# EAGLE design eigenes_OVMS (EAGLE 6.3)

## Sheet 1 of 3: Power Supply
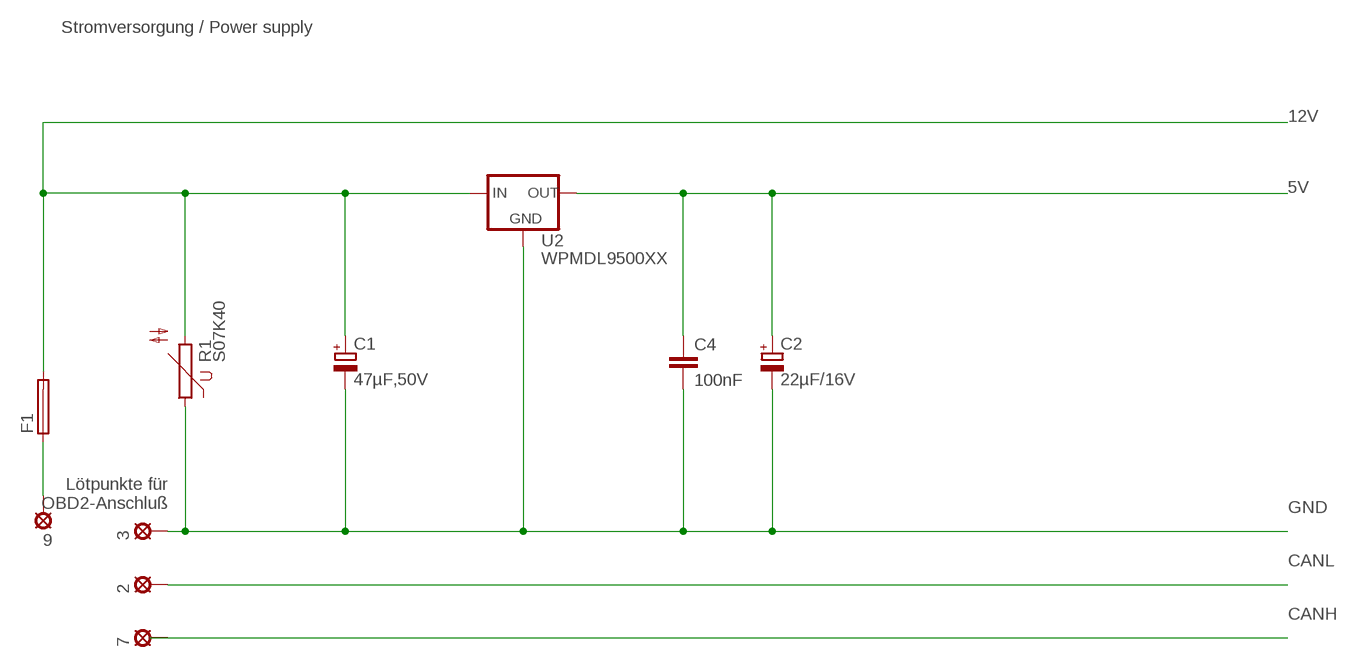
[diagram p0: schematic, sheet 1]

### Parts
2  LSP10  [LSP10]
3  LSP10  [LSP10]
7  LSP10  [LSP10]
9  LSP10  [LSP10]
C1  47µF,50V  CPOL-EUE2.5-7  [E2,5-7]
C2  22µF/16V  CPOL-EUE2.5-5  [E2,5-5]
C4  100nF  C-EU025-025X050  [C025-025X050]
F1  19559  [19559]
R1  S07K40  [S07K40]
U2  WPMDL9500XX  [WPMDL9500]

### Nets
5V: C2.+ C4.1 U2.OUT ; also sheet 2
12V: C1.+ F1.2 R1.2 U2.IN ; also sheet 2,3
CANH: 7.MP ; also sheet 2
CANL: 2.MP ; also sheet 2
GND: 3.MP C1.- C2.- C4.2 R1.1 U2.GND ; also sheet 2,3
N$2: 9.MP F1.1

### Notes on the sheet
- Stromversorgung / Power supply
- Lötpunkte für
  OBD2-Anschluß

## Sheet 2 of 3: PIC, CAN-Bus
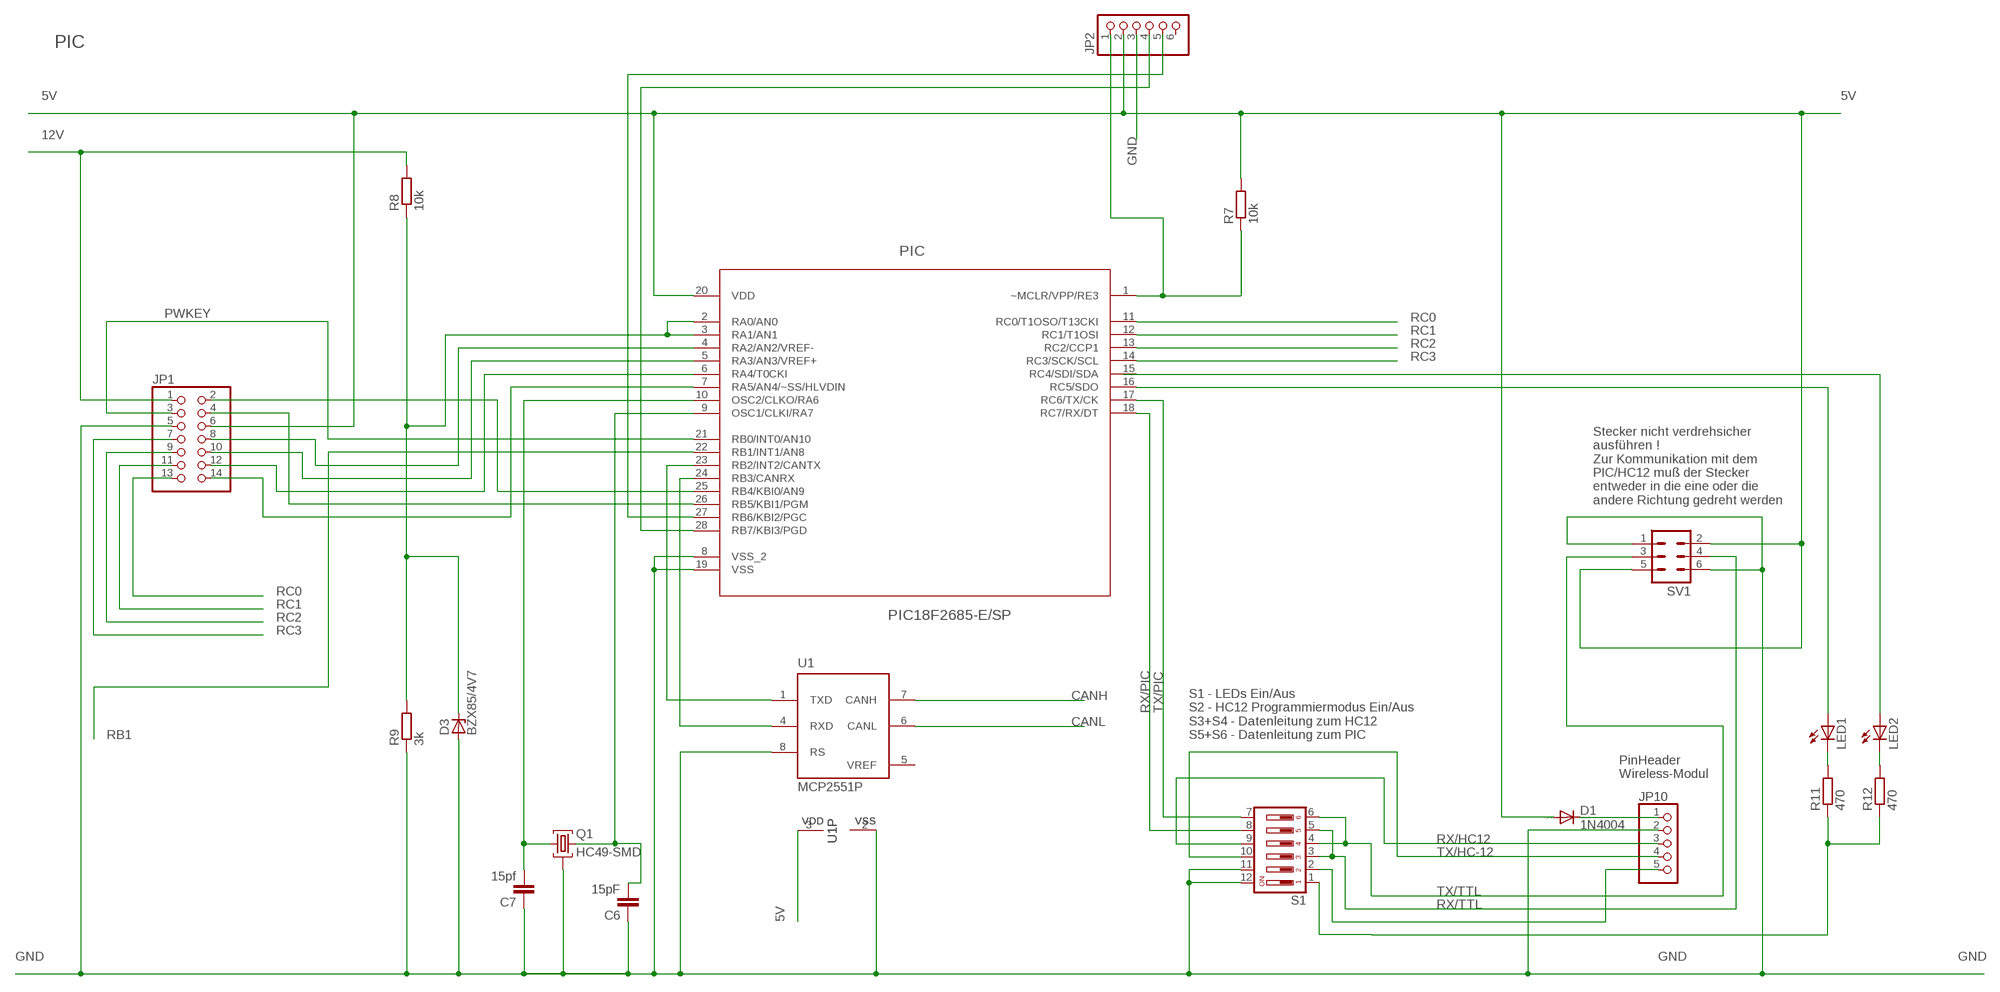
[diagram p1: schematic, sheet 2]

### Parts
C6  15pF  C-EU025-025X050  [C025-025X050]
C7  15pf  C-EU025-025X050  [C025-025X050]
D1  1N4004  [DO41-10]
D3  BZX85/4V7  BZX85  [DO41Z10]
JP1  PINHD-2X7  [2X07]
JP2  PINHD-1X6  [1X06]
JP10  PINHD-1X5  [1X05]
LED1  LED3MM  [LED3MM]
LED2  LED3MM  [LED3MM]
PIC  PIC18F2685-E/SP  [DIP254P762X508-28]
Q1  HC49-SMD  12M10BHC49T  [HC49U]
R7  10k  R-EU_0207/7  [0207/7]
R8  10k  R-EU_0207/7  [0207/7]
R9  3k  R-EU_0207/7  [0207/7]
R11  470  R-EU_0207/7  [0207/7]
R12  470  R-EU_0207/7  [0207/7]
S1  DIP06YL  [DIP06YL]
SV1  ML6L  [ML6L]
U1  MCP2551P  [DIL8]

### Nets
5V: D1.A JP1.6 JP2.2 PIC.20(VDD) R7.2 SV1.2 SV1.5 U1.3(VDD) ; also sheet 1
12V: JP1.1 R8.2 ; also sheet 1,3
CANH: U1.7(CANH) ; also sheet 1
CANL: U1.6(CANL) ; also sheet 1
GND: C6.1 C7.1 D3.A JP1.5 JP2.3 JP10.2 PIC.8(VSS_2) PIC.19(VSS) Q1.2 R9.1 S1.11 S1.12 SV1.1 SV1.6 U1.2(VSS) U1.8(RS) ; also sheet 1,3
N$1: JP2.1 PIC.1(~MCLR/VPP/RE3) R7.1
N$3: C7.2 PIC.10(OSC2/CLKO/RA6) Q1.1
N$4: C6.2 PIC.9(OSC1/CLKI/RA7) Q1.3
N$5: PIC.23(RB2/INT2/CANTX) U1.1(TXD)
N$6: PIC.24(RB3/CANRX) U1.4(RXD)
N$7: LED2.A PIC.15(RC4/SDI/SDA)
N$8: LED1.A PIC.16(RC5/SDO)
N$12: JP2.4 PIC.28(RB7/KBI3/PGD)
N$13: JP2.5 PIC.27(RB6/KBI2/PGC)
N$15: JP1.8 PIC.4(RA2/AN2/VREF-)
N$16: JP1.10 PIC.5(RA3/AN3/VREF+)
N$17: JP1.12 PIC.6(RA4/T0CKI)
N$19: D1.C JP10.1
N$20: LED1.K(C) R11.2
N$21: LED2.K(C) R12.2
N$22: R11.1 R12.1 S1.1
N$23: JP1.14 PIC.7(RA5/AN4/~SS/HLVDIN)
N$45: JP10.5 S1.2
PWKEY: JP1.3 PIC.21(RB0/INT0/AN10)
RA1: D3.C PIC.2(RA0/AN0) PIC.3(RA1/AN1) R8.1 R9.2
RB1: PIC.22(RB1/INT1/AN8) ; also sheet 3
RB4: JP1.2 PIC.25(RB4/KBI0/AN9)
RB5: JP1.4 PIC.26(RB5/KBI1/PGM)
RC0: JP1.13 PIC.11(RC0/T1OSO/T13CKI)
RC1: JP1.11 PIC.12(RC1/T1OSI)
RC2: JP1.9 PIC.13(RC2/CCP1)
RC3: JP1.7 PIC.14(RC3/SCK/SCL)
RX/HC12: JP10.3 S1.9
RX/PIC: PIC.18(RC7/RX/DT) S1.8
RX/TTL: S1.3 S1.5 SV1.4
TX/HC-12: JP10.4 S1.10
TX/PIC: PIC.17(RC6/TX/CK) S1.7
TX/TTL: S1.4 S1.6 SV1.3
Unconnected: JP2.6

### Notes on the sheet
- PIC
- Stecker nicht verdrehsicher
  ausführen !
  Zur Kommunikation mit dem
  PIC/HC12 muß der Stecker
  entweder in die eine oder die
  andere Richtung gedreht werden
- S1 - LEDs Ein/Aus
  S2 - HC12 Programmiermodus Ein/Aus
  S3+S4 - Datenleitung zum HC12
  S5+S6 - Datenleitung zum PIC
- PinHeader
  Wireless-Modul

## Sheet 3 of 3: Fan Control
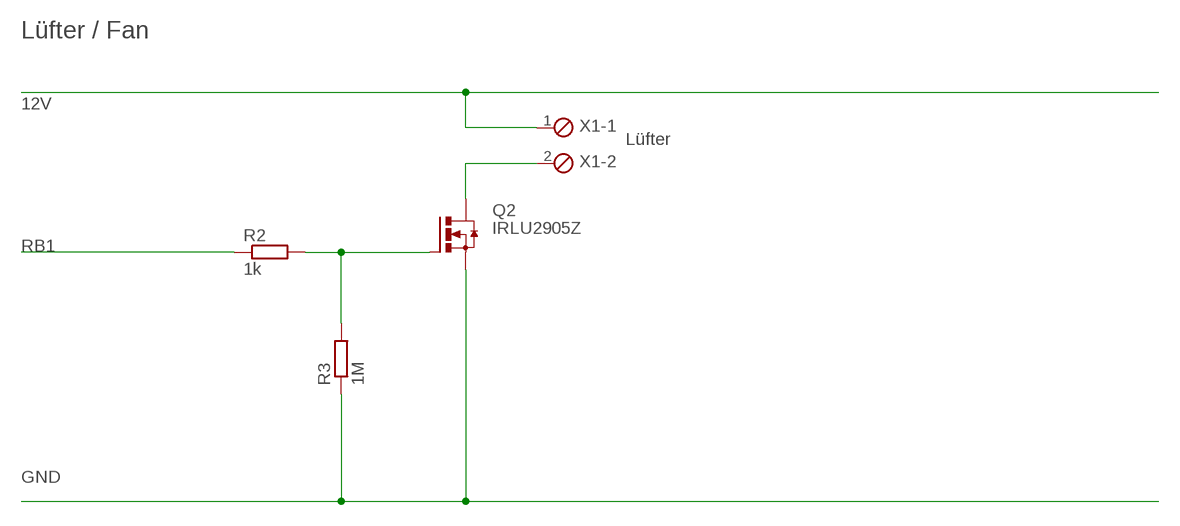
[diagram p2: schematic, sheet 3]

### Parts
Q2  IRLU2905Z  [TO251AA-V]
R2  1k  R-EU_0207/7  [0207/7]
R3  1M  R-EU_0207/7  [0207/7]
X1  MPT2  [2POL254]

### Nets
12V: X1.1 ; also sheet 1,2
GND: Q2.3(S) R3.1 ; also sheet 1,2
N$9: Q2.1(G) R2.2 R3.2
N$11: Q2.2(D) X1.2
RB1: R2.1 ; also sheet 2

### Notes on the sheet
- Lüfter / Fan
- Lüfter

## Power pins joined to a net without a drawn wire
VREF: U1.5(VREF)

## Library data of the parts
2 3 7 9 = solpad:LSP10: SOLDER PAD drill 1.0 mm, distributor Buerklin, 12H555
C1 C2 = rcl:CPOL-EU: POLARIZED CAPACITOR, European symbol
C4 C6 C7 = rcl:C-EU: CAPACITOR, European symbol
D1 = diode:1N4004: DIODE general purpose rectifier, 1 A
D3 = diode:BZX85: Z DIODE
F1 = fuse:19559: FUSE HOLDER TR5, Wickmann; MPN: 55900000001; OC_FARNELL: 9516360; OC_NEWARK: 02P0286
JP1 = pinhead:PINHD-2X7: PIN HEADER
JP2 = pinhead:PINHD-1X6: PIN HEADER
JP10 = pinhead:PINHD-1X5: PIN HEADER
LED1 LED2 = led:LED: LED OSRAM: - CHIPLED LG R971, LG N971, LY N971, LG Q971, LY Q971, LO R971, LY R971 LH N974, LH R974 LS Q976, LO Q976, LY Q976 LO Q996 - Hyper CHIPLED LW Q18S LB Q993, LB Q99A, LB R99A - SideLED LS A670, LO A670, LY A670, LG A670, LP A670 LB A673, LV A673, LT A673, LW A673 LH A674 LY A675 LS A676, LA A676, LO A676, LY A676, LW A676 LS A679, LY A679, LG A679 - Hyper Micro SIDELED® LS Y876, LA Y876, LO Y876, LY Y876 LT Y87S - SmartLED LW L88C, LW L88S LB L89C, LB L89S, LG L890 LS L89K, LO L89K, LY L89K LS L896, LA L896, LO L896, LY L896 - TOPLED LS T670, LO T670, LY T670, LG T670, LP T670 LSG T670, LSP T670, LSY T670, LOP T670, LYG T670 LG T671, LOG T671, LSG T671 LB T673, LV T673, LT T673, LW T673 LH T674 LS T676, LA T676, LO T676, LY T676, LB T676, LH T676, LSB T676, LW T676 LB T67C, LV T67C, LT T67C, LS T67K, LO T67K, LY T67K, LW E67C LS E67B, LA E67B, LO E67B, LY E67B, LB E67C, LV E67C, LT E67C LW T67C LS T679, LY T679, LG T679 LS T770, LO T770, LY T770, LG T770, LP T770 LB T773, LV T773, LT T773, LW T773 LH T774 LS E675, LA E675, LY E675, LS T675 LS T776, LA T776, LO T776, LY T776, LB T776 LHGB T686 LT T68C, LB T68C - Hyper Mini TOPLED® LB M676 - Mini TOPLED Santana® LG M470 LS M47K, LO M47K, LY M47K Source: http://www.osram.convergy.de LUXEON: - LUMILED® LXK2-PW12-R00, LXK2-PW12-S00, LXK2-PW14-U00, LXK2-PW14-V00 LXK2-PM12-R00, LXK2-PM12-S00, LXK2-PM14-U00 LXK2-PE12-Q00, LXK2-PE12-R00, LXK2-PE12-S00, LXK2-PE14-T00, LXK2-PE14-U00 LXK2-PB12-K00, LXK2-PB12-L00, LXK2-PB12-M00, LXK2-PB14-N00, LXK2-PB14-P00, LXK2-PB14-Q00 LXK2-PR12-L00, LXK2-PR12-M00, LXK2-PR14-Q00, LXK2-PR14-R00 LXK2-PD12-Q00, LXK2-PD12-R00, LXK2-PD12-S00 LXK2-PH12-R00, LXK2-PH12-S00 LXK2-PL12-P00, LXK2-PL12-Q00, LXK2-PL12-R00 Source: www.luxeon.com KINGBRIGHT: KA-3528ASYC Source: www.kingbright.com
PIC = Microchip_By_element14_Batch_1:PIC18F2685-E/SP: Enhanced Flash Microcontrollers; DESCRIPTION: Enhanced Flash Microcontrollers; MPN: PIC18F2685-E/SP; OC_FARNELL: 1579606; OC_NEWARK: 08N6592; PACKAGE: DIP-28; SUPPLIER: Microchip
Q1 = crystal:12M10BHC49T: Monolithic Crystal Filters Source: www.vanlong.com; OC_FARNELL: unknown; OC_NEWARK: unknown
Q2 = transistor-power:IRLU2905Z: HEXFET-Power MOSFET Automotive
R1 = varistor:S07K40: VARISTOR
R2 R3 = resistor:R-EU_: RESISTOR, European symbol
R7-R9 R11 R12 = rcl:R-EU_: RESISTOR, European symbol
S1 = switch-dil:DIP06YL: DIL/CODE SWITCH; OC_FARNELL: unknown; OC_NEWARK: unknown
SV1 = con-harting-ml:ML6: HARTING; OC_FARNELL: unknown; OC_NEWARK: unknown
U1 = microchip_can:MCP2551: High Speed CAN tranceiver
U2 = v-reg:WPMDL9500XX: Voltage Regulator Würth
X1 = con-phoenix-254:MPT2: PHOENIX CONNECTOR; OC_FARNELL: unknown; OC_NEWARK: unknown

## Board
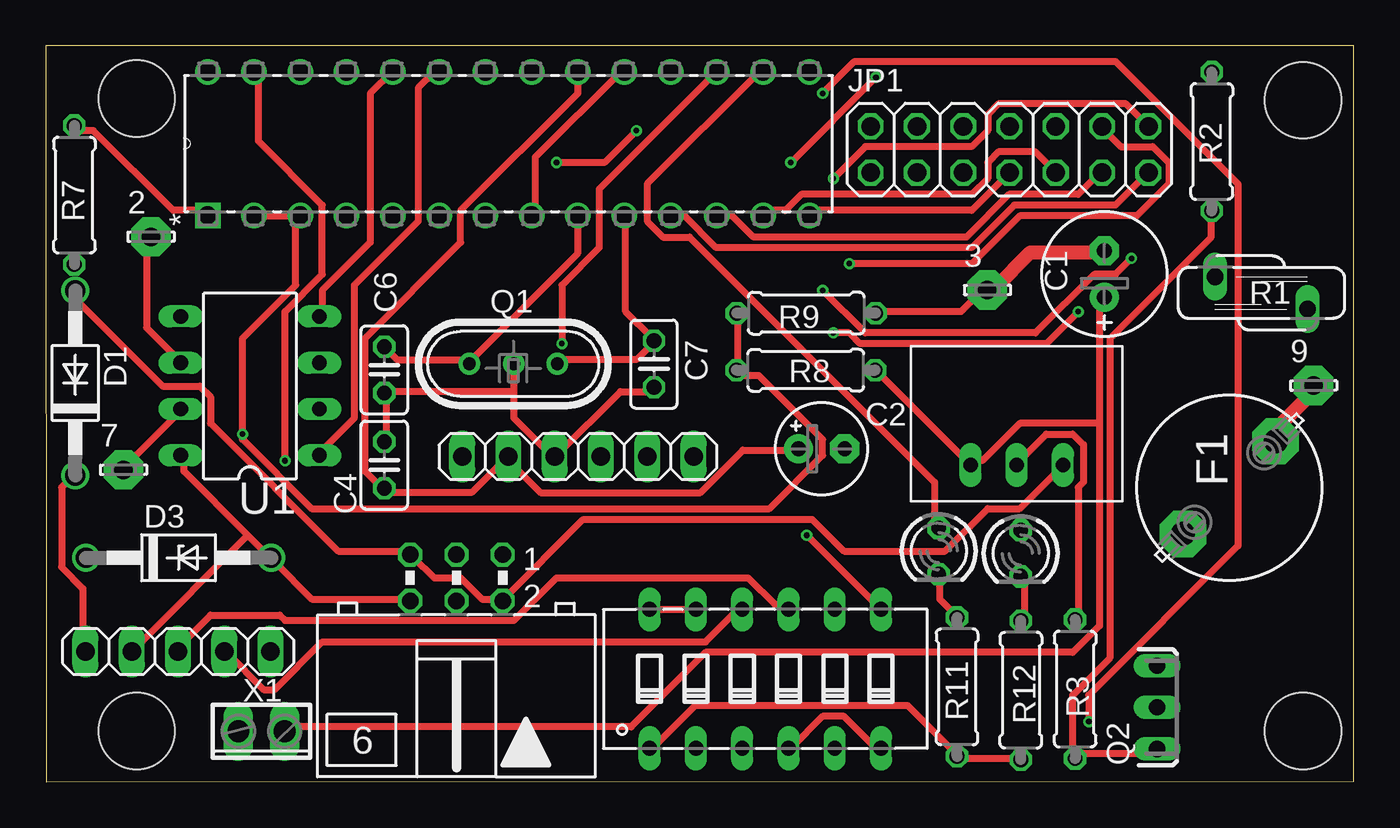
[diagram p3: board, top side]
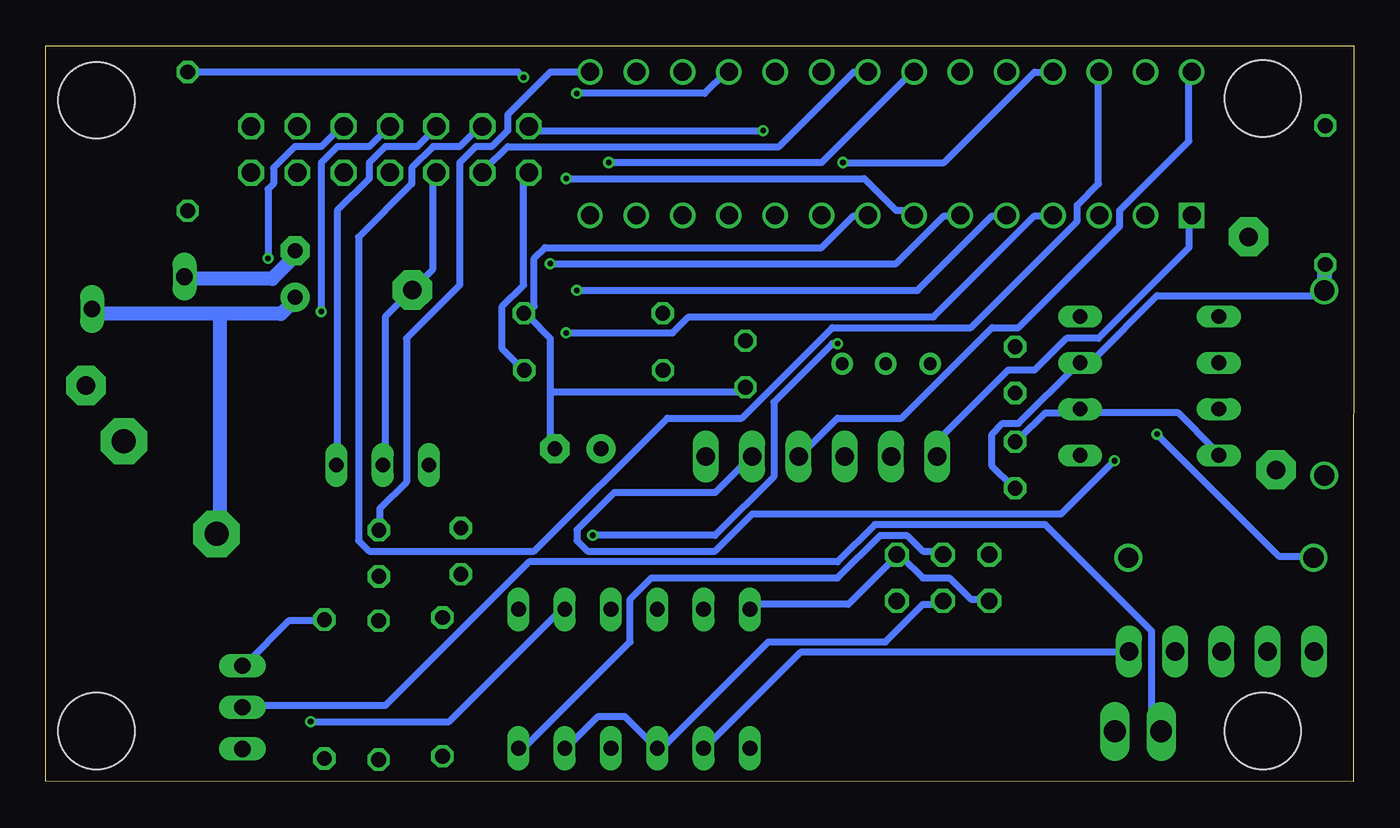
[diagram p4: board, bottom side, seen from below]

Size 71.8 x 40.4 mm. Coordinates in mm from the lower left corner, seen from the top.
Outline: 0.05,0 71.8,0.04 71.8,40.4 0,40.4 0.05,0
Copper layers (1*16): Top 0.035mm / dielectric 1.5mm / Bottom 0.035mm
Design rules "basista_035um-cu_dicke *": minimum track width 15mil, minimum drill 12mil, track to track 8mil, track to pad 8mil, pad to pad 8mil, via to via 8mil, smd to smd 6mil, copper to edge 20mil, drill to drill 8mil, minimum pad ring 8mil, minimum via ring 6mil, stop-mask expansion 3mil, vias tented up to drill 0mil, thermal gap 8mil
Holes 4.2 mm at 5,37.5 5,2.8 69,2.8 69,37.4

### Footprints (pad centres in the part's own frame; a part is rotated, then mirrored left to right if it is on the bottom)
LSP10 = drill 1.016 pad 2.159 octagon: MP 0,0
E2,5-7 = drill 0.813 pad 1.6: + -1.27,0 | drill 0.813 pad 1.6 octagon: - 1.27,0
E2,5-5 = drill 0.813 pad 1.6: + -1.27,0 | drill 0.813 pad 1.6 octagon: - 1.27,0
C025-025X050 = drill 0.813 octagon: 1 -1.27,0; 2 1.27,0
DO41-10 = drill 1.118: A 5.08,0; C -5.08,0
DO41Z10 = drill 1.118: A 5.08,0; C -5.08,0
19559 = drill 1.321 pad 2.54 octagon: 1 -2.54,2.54; 2 2.54,-2.54
2X07 = drill 1.016 octagon: 1 -7.62,-1.27; 2 -7.62,1.27; 3 -5.08,-1.27; 4 -5.08,1.27; 5 -2.54,-1.27; 6 -2.54,1.27; 7 0,-1.27; 8 0,1.27; 9 2.54,-1.27; 10 2.54,1.27; 11 5.08,-1.27; 12 5.08,1.27; 13 7.62,-1.27; 14 7.62,1.27
1X06 = drill 1.016 long: 1 -6.35,0; 2 -3.81,0; 3 -1.27,0; 4 1.27,0; 5 3.81,0; 6 6.35,0
1X05 = drill 1.016 long: 1 -5.08,0; 2 -2.54,0; 3 0,0; 4 2.54,0; 5 5.08,0
LED3MM = drill 0.813 octagon: A -1.27,0; K 1.27,0
DIP254P762X508-28 = drill 0.991 square: 1 -7.874,33.02 | drill 0.991: 2 -7.874,30.48; 3 -7.874,27.94; 4 -7.874,25.4; 5 -7.874,22.86; 6 -7.874,20.32; 7 -7.874,17.78; 8 -7.874,15.24; 9 -7.874,12.7; 10 -7.874,10.16; 11 -7.874,7.62; 12 -7.874,5.08; 13 -7.874,2.54; 14 -7.874,0; 15 0,0; 16 0,2.54; 17 0,5.08; 18 0,7.62; 19 0,10.16; 20 0,12.7; 21 0,15.24; 22 0,17.78; 23 0,20.32; 24 0,22.86; 25 0,25.4; 26 0,27.94; 27 0,30.48; 28 0,33.02
HC49U = drill 0.7 pad 1.2: 1 -2.413,0; 2 -0.027,0; 3 2.413,0
TO251AA-V = drill 0.889 long: 1 -2.286,0; 2 0,0; 3 2.286,0
S07K40 = drill 0.914 long: 1 -0.889,-2.54; 2 0.889,2.54
0207/7 = drill 0.813 octagon: 1 -3.81,0; 2 3.81,0
DIP06YL = drill 0.813 long: 1 -6.35,-3.81; 2 -3.81,-3.81; 3 -1.27,-3.81; 4 1.27,-3.81; 5 3.81,-3.81; 6 6.35,-3.81; 7 6.35,3.81; 8 3.81,3.81; 9 1.27,3.81; 10 -1.27,3.81; 11 -3.81,3.81; 12 -6.35,3.81
ML6L = drill 0.914 octagon: 1 -2.54,-1.27; 2 -2.54,1.27; 3 0,-1.27; 4 0,1.27; 5 2.54,-1.27; 6 2.54,1.27
DIL8 = drill 0.813 long: 1 -3.81,-3.81; 2 -1.27,-3.81; 3 1.27,-3.81; 4 3.81,-3.81; 5 3.81,3.81; 6 1.27,3.81; 7 -1.27,3.81; 8 -3.81,3.81
WPMDL9500 = drill 0.8 long: GND 0,0; IN -2.54,0; OUT 2.54,0
2POL254 = drill 1.2 long: 1 -1.27,0; 2 1.27,0

### Placement (x,y rotation side)
2  5.78,29.91 0 top
3  51.68,26.99 0 top
7  4.28,17.13 0 top
9  69.58,21.75 0 top
C1  58.11,27.87 90 top
C2  42.58,18.28 0 top
C4  18.59,17.39 90 top
C6  18.59,22.61 90 top
C7  33.39,22.93 90 top
D1  1.63,21.89 90 top
D3  7.3,12.3 0 top
F1  64.96,16.15 270 top
JP1  52.9,34.7 0 top
JP2  29.21,17.86 0 top
JP10  7.27,7.16 0 top
LED1  49.01,12.67 270 top
LED2  53.51,12.55 270 top
PIC  41.92,38.96 90 top
Q1  25.67,22.94 180 top
Q2  61,4.1 90 top
R1  66.71,26.83 270 top
R2  64,35.14 270 top
R3  56.5,5.1 270 top
R7  1.58,32.2 270 top
R8  41.72,22.59 0 top
R9  41.74,25.72 180 top
R11  50.02,5.22 90 top
R12  53.52,5.04 90 top
S1  39.5,5.66 0 top
SV1  22.55,11.2 180 top
U1  11.22,21.73 90 top
U2  53.3,17.4 0 top
X1  11.85,2.78 180 top

### Tracks (layer width: path | path; a pad name or v marks a point on that pad's centre or on a via)
5V
  Top 0.381: 1.75,26.97 D1.A 1.46,26.68 6.43,21.71 8.47,21.71 9.05,21.13 9.05,19.67 16.07,12.66 19.86,12.66 SV1.5 20.16,12.36 21.32,11.2 22.78,11.2 23.95,10.03 24.83,10.03 SV1.2 25.12,10.03 29.5,14.41 42.06,14.41 43.81,12.66 49.37,12.66 51.7,14.99 53.45,14.99 55.79,17.33 U2.OUT | PIC.20 29.21,38.95 29.21,37.78 22.78,31.35 22.78,29.6 17.53,24.34 17.53,17.04 18.4,16.16 C4.1 18.69,15.87 23.37,15.87 25.12,17.62 JP2.2 25.41,17.62 27.16,15.87 35.93,15.87 38.27,18.21 41.19,18.21 C2.+
  Bottom 0.381: U2.OUT 55.79,17.62 55.79,31.35 54.04,33.1 54.04,33.98 53.16,34.86 51.41,34.86 50.53,35.73 JP1.6 | C4.1 18.69,16.16 19.86,17.33 19.86,19.08 19.28,19.67 18.4,19.67 15.19,22.88 U1.3 14.9,23.17 14.31,23.17 10.81,26.68 1.75,26.68 D1.A
  Bottom 0.813: R7.2 1.63,28.39 D1.A
12V
  Top 0.381: R8.2 45.57,22.59 50.53,17.62 U2.IN 50.83,17.62 51.41,17.62 53.45,19.67 57.84,19.67 | 57.84,19.67 57.84,26.39 C1.+ | 57.84,19.67 57.84,8.57 56.38,7.11 36.22,7.11 32.13,3.02 13.14,3.02 X1.1
  Bottom 0.381: JP1.1 45.57,33.4 45.57,27.26 46.74,26.09 46.74,23.76 45.57,22.59 R8.2
  Bottom 0.762: 62.26,25.67 58.88,25.67 58.4,26.16 C1.+ | 62.26,25.67 69.01,25.67 R1.2 | 62.26,25.67 62.26,13.61 F1.2
CANH
  Top 0.381: U1.7 7.3,20.25 4.38,17.33 7.MP
CANL
  Top 0.381: U1.6 7.3,23.17 5.55,24.92 5.55,29.89 2.MP
GND
  Top 0.381: C4.2 18.69,18.79 18.69,21.13 C6.1 18.69,21.42 25.7,21.42 | 25.7,21.42 25.7,19.96 27.75,17.91 JP2.3 28.04,17.91 31.55,21.42 33.3,21.42 C7.1 | 25.7,21.42 25.7,22.88 Q1.2 | S1.12 33.3,9.44 35.64,9.44 S1.11 | 11.1,13.53 12.27,12.36 D3.A 12.56,12.07 14.61,10.03 19.86,10.03 SV1.6 | 11.1,13.53 7.59,17.04 7.59,17.91 U1.8 | 11.1,13.53 4.97,7.4 JP10.2 | PIC.8 26.87,31.35 26.87,34.27 31.55,38.95 PIC.19 | R9.1 45.57,25.8 50.24,25.8 51.41,26.97 3.MP | R3.1 56.67,9.15 56.67,16.16 56.96,16.45 56.96,18.5 56.38,19.08 54.91,19.08 53.45,17.62 U2.GND
  Top 0.762: C1.- 57.91,29.05 54.05,29.05 52.12,27.12 3.MP
  Bottom 0.381: C4.2 18.4,18.79 16.94,20.25 15.19,20.25 U1.2 14.9,20.25 9.64,20.25 7.59,18.21 U1.8 | SV1.6 20.16,10.03 21.03,10.03 22.2,11.2 23.66,11.2 24.83,12.36 SV1.1 25.12,12.36 27.75,9.74 33.01,9.74 S1.12 | R3.1 56.67,8.86 58.42,8.86 60.76,6.52 Q2.3 | U2.GND 53.16,17.62 53.16,25.51 51.7,26.97 3.MP 51.41,27.26 50.53,28.14 50.53,33.4 JP1.5 | 44.11,21.42 44.11,24.34 45.28,25.51 R9.1 45.28,25.8 44.98,26.09 44.98,28.72 44.4,29.31 29.21,29.31 27.46,31.06 26.87,31.06 PIC.8 | 44.11,21.42 44.11,18.5 C2.- | 44.11,21.42 33.59,21.42 C7.1
  Bottom 0.762: R1.1 63.7,27.6 59.36,27.6 57.91,29.05 C1.-
N$1
  Top 0.381: R7.1 1.75,35.73 2.63,35.73 7.01,31.35 8.76,31.35 PIC.1
  Bottom 0.381: JP2.1 22.78,17.91 22.78,18.79 18.99,22.59 17.53,22.59 15.77,24.34 14.02,24.34 9.05,29.31 9.05,31.06 PIC.1
N$2
  Top 0.762: 9.MP 69.49,21.33 67.08,18.92 F1.1
N$3
  Top 0.381: Q1.1 28.33,23.17 32.42,23.17 33.3,24.05 C7.2 33.3,24.34 31.84,25.8 31.84,31.06 PIC.10
N$4
  Top 0.381: C6.2 18.69,23.76 19.28,23.17 23.08,23.17 Q1.3 23.37,23.17 29.21,29.01 29.21,31.06 PIC.9
N$5
  Top 0.381: U1.1 15.19,18.21 16.94,19.96 16.94,27.26 20.45,30.77 20.45,38.07 21.32,38.95 PIC.23
N$6
  Top 0.381: U1.4 15.19,25.8 15.19,26.97 17.82,29.6 17.82,37.78 18.99,38.95 PIC.24
N$7
  Bottom 0.381: LED2.A 53.45,13.83 53.45,14.99 51.99,16.45 51.99,24.34 49.07,27.26 49.07,33.98 48.2,34.86 47.32,34.86 46.44,35.73 46.44,36.61 44.11,38.95 42.06,38.95 PIC.15
N$8
  Top 0.381: LED1.A 48.78,14.12 48.78,16.45 35.34,29.89 33.88,29.89 33.01,30.77 33.01,32.81 39.14,38.95 PIC.16
N$9
  Top 0.381: Q2.1 60.76,1.56 56.67,1.56 R3.2 56.38,1.56 56.38,4.77 58.42,6.81 58.42,24.34 63.97,29.89 63.97,31.06 R2.2
N$11
  Bottom 0.381: Q2.2 60.76,4.19 53.16,4.19 45.28,12.07 28.33,12.07 26.29,14.12 16.94,14.12 11.1,8.28 11.1,3.31 10.81,3.02 X1.2
N$12
  Bottom 0.381: PIC.28 9.05,38.95 9.05,35.15 12.85,31.35 12.85,30.47 18.4,24.92 19.86,24.92 24.83,19.96 28.33,19.96 30.38,17.91 JP2.4
N$13  (via drill 0.3)
  Top 0.381: v13.14,17.62 13.14,25.8 15.19,27.85 15.19,31.64 11.68,35.15 11.68,38.95 PIC.27
  Bottom 0.381: v13.14,17.62 16.07,14.7 33.01,14.7 35.05,12.66 42.06,12.66 42.65,13.24 42.65,13.83 40.6,15.87 35.05,15.87 33.3,17.62 JP2.5
N$15  (via drill 0.3)
  Top 0.381: v43.23,24.63 44.11,24.63 44.69,24.05 54.91,24.05 v56.67,25.8
  Bottom 0.381: v43.23,24.63 37.39,24.63 36.51,25.51 23.08,25.51 17.53,31.06 16.65,31.06 PIC.4 | v56.67,25.8 56.67,33.98 55.79,34.86 54.04,34.86 53.16,35.73 JP1.8
N$16  (via drill 0.3)
  Top 0.381: v42.65,26.97 44.98,24.63 54.33,24.63 57.54,27.85 58.71,27.85 v59.59,28.72
  Bottom 0.381: v42.65,26.97 23.95,26.97 19.86,31.06 19.28,31.06 PIC.5 | v59.59,28.72 59.59,32.52 59.3,32.81 59.3,33.69 58.13,34.86 56.67,34.86 55.5,36.02 JP1.10
N$17  (via drill 0.3)
  Top 0.381: v44.11,28.43 50.83,28.43 53.45,31.06 59.88,31.06 61.63,32.81 61.63,33.98 60.76,34.86 59,34.86 58.13,35.73 JP1.12
  Bottom 0.381: v44.11,28.43 25.12,28.43 22.49,31.06 21.61,31.06 PIC.6
N$19
  Top 0.381: JP10.1 2.04,7.4 2.04,10.61 0.88,11.78 0.88,16.16 1.46,16.75 D1.C
N$20
  Top 0.381: LED1.K 49.07,11.2 49.07,10.03 49.95,9.15 R11.2
N$21
  Top 0.381: LED2.K 53.75,11.2 53.75,8.86 R12.2
N$22
  Top 0.381: R12.1 53.45,1.26 50.24,1.26 R11.1 49.95,1.56 47.32,4.19 35.64,4.19 33.3,1.85 S1.1
N$23  (via drill 0.3)
  Top 0.381: v43.23,33.1 44.98,34.86 50.83,34.86 51.7,35.73 51.7,36.61 52.29,37.19 59.3,37.19 60.47,36.02 JP1.14
  Bottom 0.381: v43.23,33.1 26.87,33.1 25.12,31.35 24.24,31.35 PIC.7
N$45
  Bottom 0.381: S1.2 35.64,1.85 30.38,7.11 12.56,7.11 JP10.5
PWKEY
  Bottom 0.381: PIC.21 26.87,38.95 27.46,38.95 31.55,34.86 46.44,34.86 47.61,33.69 JP1.3
RA1  (via drill 0.3)
  Top 0.381: R9.2 37.97,25.51 37.97,22.59 R8.1 37.97,22.3 39.14,22.3 42.65,18.79 42.65,17.91 39.73,14.99 14.61,14.99 10.81,18.79 v10.81,19.08 10.81,24.34 13.73,27.26 13.73,31.06 PIC.3
  Top 0.406: 13.73,31.06 11.44,31.06 PIC.2
  Bottom 0.381: v10.81,19.08 4.09,12.36 2.34,12.36 D3.C
RB1  (via drill 0.3)
  Top 0.381: v40.89,33.98 v45.57,38.65
  Bottom 0.381: v45.57,38.65 45.86,38.95 63.97,38.95 R2.1 | v40.89,33.98 29.21,33.98 24.24,38.95 PIC.22
RB4  (via drill 0.3)
  Top 0.381: v28.04,33.98 30.67,33.98 v32.42,35.73
  Bottom 0.381: v28.04,33.98 22.49,33.98 17.53,38.95 16.65,38.95 PIC.25 | v32.42,35.73 45.28,35.73 JP1.2
RB5
  Bottom 0.381: PIC.26 14.02,38.95 14.02,32.81 15.19,31.64 15.19,30.77 21.03,24.92 28.63,24.92 33.59,19.96 37.68,19.96 44.98,12.66 54.04,12.66 54.62,13.24 54.62,29.89 51.7,32.81 51.7,33.69 50.53,34.86 49.07,34.86 47.9,36.02 JP1.4
RC0
  Top 0.381: PIC.11 34.47,31.06 35.05,31.06 36.8,29.31 50.83,29.31 53.16,31.64 58.71,31.64 60.47,33.4 JP1.13
RC1
  Top 0.381: PIC.12 37.1,31.06 37.68,31.06 38.85,29.89 50.53,29.89 52.87,32.23 56.67,32.23 57.84,33.4 JP1.11
RC2
  Top 0.381: PIC.13 39.43,31.35 40.6,31.35 41.48,32.23 50.83,32.23 51.7,33.1 51.7,33.98 52.29,34.56 54.33,34.56 55.21,33.69 JP1.9
RC3
  Top 0.381: PIC.14 42.06,31.35 50.83,31.35 52.87,33.4 JP1.7
RX/HC12
  Top 0.381: S1.9 40.6,9.74 40.02,9.74 38.56,11.2 28.04,11.2 25.7,8.86 13.14,8.86 12.85,9.15 9.05,9.15 7.3,7.4 JP10.3
RX/PIC  (via drill 0.3)
  Top 0.381: v57.25,3.31 57.25,4.77 65.43,12.95 65.43,32.81 58.71,39.53 44.4,39.53 v42.65,37.78
  Bottom 0.381: v57.25,3.31 49.66,3.31 43.52,9.44 S1.8 | v42.65,37.78 35.64,37.78 34.47,38.95 PIC.18
RX/TTL
  Bottom 0.381: S1.5 43.23,1.85 41.48,3.6 40.02,3.6 38.27,1.85 S1.3 37.97,1.85 32.13,7.69 25.7,7.69 23.66,9.74 22.78,9.74 SV1.4
TX/HC-12
  Top 0.381: S1.10 37.97,9.44 36.22,7.69 15.19,7.69 12.56,5.06 11.98,5.06 9.93,7.11 JP10.4
TX/PIC  (via drill 0.3)
  Top 0.381: v41.77,13.53 45.57,9.74 S1.7 | v28.33,24.05 28.33,27.26 30.38,29.31 30.38,32.52 36.8,38.95 PIC.17
  Bottom 0.381: v41.77,13.53 35.05,13.53 31.84,16.75 31.84,20.84 28.63,24.05 v28.33,24.05
TX/TTL
  Top 0.381: S1.4 40.89,1.85 42.65,3.6 43.81,3.6 45.57,1.85 S1.6
  Bottom 0.381: SV1.3 22.78,12.66 23.66,12.66 24.54,13.53 26,13.53 28.33,11.2 38.56,11.2 39.73,10.03 39.73,7.69 45.57,1.85 S1.6